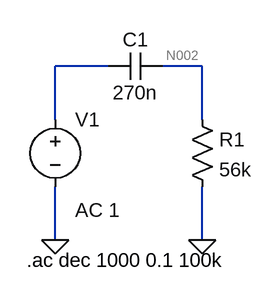
[diagram p0: schematic Draft1.asc]
Draft1.asc, the LTspice schematic file:
Version 4
SHEET 1 880 680
WIRE -16 144 -80 144
WIRE 96 144 48 144
WIRE -80 208 -80 144
WIRE 96 208 96 144
WIRE -80 352 -80 288
WIRE 96 352 96 288
FLAG -80 352 0
FLAG 96 352 0
SYMBOL cap 48 128 R90
WINDOW 0 0 32 VBottom 2
WINDOW 3 32 32 VTop 2
SYMATTR InstName C1
SYMATTR Value 270n
SYMBOL res 80 192 R0
SYMATTR InstName R1
SYMATTR Value 56k
SYMBOL voltage -80 192 R0
WINDOW 123 24 124 Left 2
WINDOW 39 0 0 Left 2
SYMATTR InstName V1
SYMATTR Value ""
SYMATTR Value2 AC 1
TEXT -114 376 Left 2 !.ac dec 1000 0.1 100k

The netlist it stands for:
* Draft1.asc
C1 N002 N001 270n
R1 N002 0 56k
V1 N001 0 AC 1
.ac dec 1000 0.1 100k
.backanno
.end

* Results of the author's LTspice run, read from the files saved beside the schematic
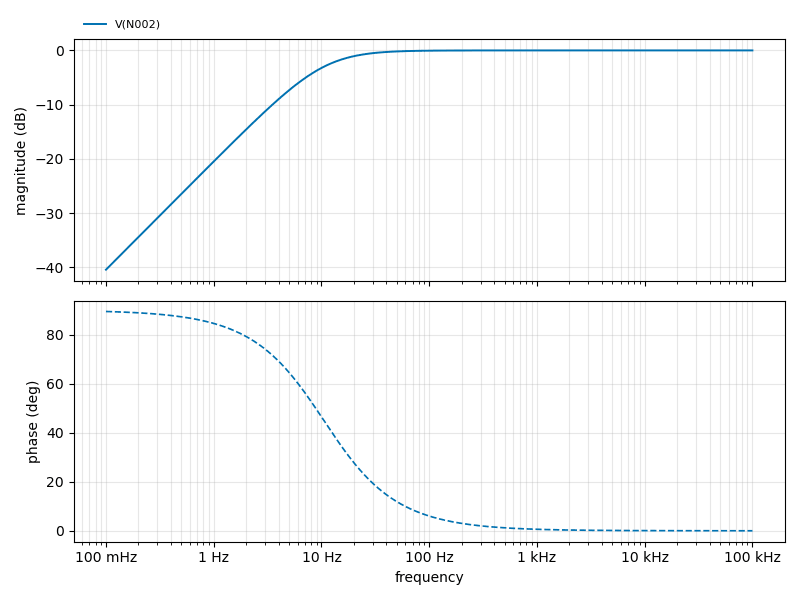
[diagram p1: AC Analysis of Draft1.asc, plotted from the saved traces]
* AC Analysis, 1 run:
*   V(N002): -40.45 dB at 100 mHz, -0.00 dB at 100 kHz, peak -0.00 dB at 100 kHz, 3 dB below the peak at 10.53 Hz